# Altium project Senior Design Project.PrjPcb
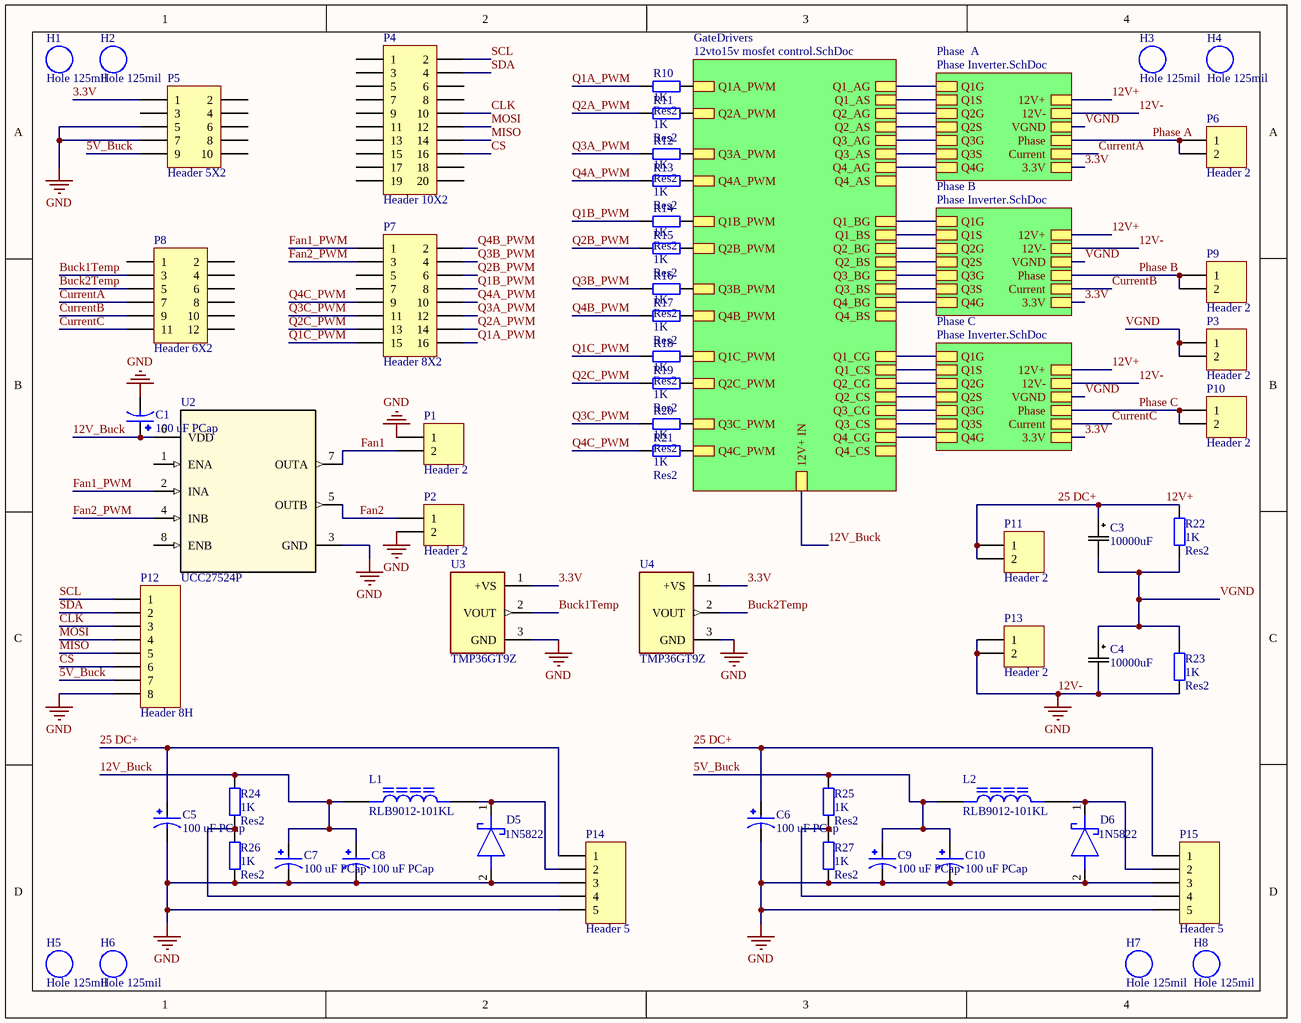
[diagram p0: DCtoAC Schematic.SchDoc]
4 sheets, 186 parts. Net scope: hierarchical (ports join the sheet entries above them; power ports are global).
Board file: Inverter PCB.PcbDoc
Sheets:
  DCtoAC Schematic.SchDoc
    GateDrivers = 12vto15v mosfet control.SchDoc
      Power = Power Supply.SchDoc
    Phase  A = Phase Inverter.SchDoc
    Phase B = Phase Inverter.SchDoc
    Phase C = Phase Inverter.SchDoc

## Sheet DCtoAC Schematic.SchDoc
size A; SheetNumber: 1; SheetTotal: 4; SPICEModelCacheUNANASZX: <root> / <DocumentId>UNANASZX</DocumentId> / </root>

### Parts
C1  100 uF PCap  [100uF PCap]
C3  10000uF  [CAP_UBY_18X35P5_NCH]
C4  10000uF  [CAP_UBY_18X35P5_NCH]
C5  100 uF PCap  [100uF PCap]
C6  100 uF PCap  [100uF PCap]
C7  100 uF PCap  [100uF PCap]
C8  100 uF PCap  [100uF PCap]
C9  100 uF PCap  [100uF PCap]
C10  100 uF PCap  [100uF PCap]
D5  1N5822  [DIOAD3070W130L950D530]
D6  1N5822  [DIOAD3070W130L950D530]
H1  Hole 125mil  [Hole 125mil]
H2  Hole 125mil  [Hole 125mil]
H3  Hole 125mil  [Hole 125mil]
H4  Hole 125mil  [Hole 125mil]
H5  Hole 125mil  [Hole 125mil]
H6  Hole 125mil  [Hole 125mil]
H7  Hole 125mil  [Hole 125mil]
H8  Hole 125mil  [Hole 125mil]
L1  RLB9012-101KL  [IND_RLB9012-101KL]
L2  RLB9012-101KL  [IND_RLB9012-101KL]
P1  Header 2  [HDR1X2]
P2  Header 2  [HDR1X2]
P3  Header 2  [HDR1X2]
P4  Header 10X2  [HDR2X10]
P5  Header 5X2  [HDR2X5]
P6  Header 2  [HDR1X2]
P7  Header 8X2  [HDR2X8]
P8  Header 6X2  [HDR2X6]
P9  Header 2  [HDR1X2]
P10  Header 2  [HDR1X2]
P11  Header 2  [HDR1X2]
P12  Header 8H  [HDR1X8H]
P13  Header 2  [HDR1X2]
P14  Header 5  [HDR1X5]
P15  Header 5  [HDR1X5]
R10  Res2  value 1K  [AXIAL-0.4]
R11  Res2  value 1K  [AXIAL-0.4]
R12  Res2  value 1K  [AXIAL-0.4]
R13  Res2  value 1K  [AXIAL-0.4]
R14  Res2  value 1K  [AXIAL-0.4]
R15  Res2  value 1K  [AXIAL-0.4]
R16  Res2  value 1K  [AXIAL-0.4]
R17  Res2  value 1K  [AXIAL-0.4]
R18  Res2  value 1K  [AXIAL-0.4]
R19  Res2  value 1K  [AXIAL-0.4]
R20  Res2  value 1K  [AXIAL-0.4]
R21  Res2  value 1K  [AXIAL-0.4]
R22  Res2  value 1K  [AXIAL-0.4]
R23  Res2  value 1K  [AXIAL-0.4]
R24  Res2  value 1K  [AXIAL-0.4]
R25  Res2  value 1K  [AXIAL-0.4]
R26  Res2  value 1K  [AXIAL-0.4]
R27  Res2  value 1K  [AXIAL-0.4]
U2  UCC27524P  [P0008A]
U3  TMP36GT9Z  [TO92127P521H733-3]
U4  TMP36GT9Z  [TO92127P521H733-3]

### Sub-sheets
GateDrivers = 12vto15v mosfet control.SchDoc: Q1A_PWM, Q1_AG, Q1_AS, Q2A_PWM, Q2_AG, Q2_AS, Q3A_PWM, Q3_AG, Q3_AS, Q4A_PWM, Q4_AG, Q4_AS, Q1B_PWM, Q1_BG, Q1_BS, Q2B_PWM, Q2_BG, Q2_BS, Q3B_PWM, Q3_BG, Q3_BS, Q4B_PWM, Q4_BG, Q4_BS, Q1C_PWM, Q1_CG, Q1_CS, Q2C_PWM, Q2_CG, Q2_CS, Q3C_PWM, Q3_CG, Q3_CS, Q4C_PWM, Q4_CG, Q4_CS, 12V+ IN
Phase  A = Phase Inverter.SchDoc: Q1G, Q2G, Q3G, 12V+, Q1S, Q3S, 12V-, Q4G, Q2S, Phase, VGND, 3.3V, Current
Phase B = Phase Inverter.SchDoc: Q1G, Q2G, Q3G, 12V+, Q1S, Q3S, 12V-, Q4G, Q2S, Phase, VGND, Current, 3.3V
Phase C = Phase Inverter.SchDoc: Q1G, Q2G, Q3G, 12V+, Q1S, Q3S, 12V-, Q4G, Q2S, Phase, VGND, Current, 3.3V

### Nets
12V-: C1.N C4.2 C5.N C6.N C7.N C8.N C9.N C10.N D5.2(A) D6.2(A) P1.1 P2.2 P5.5 P5.7 P12.8 P13.1 P13.2 P14.3 P14.5 P15.3 P15.5 R23.1 R26.2 R27.2 U2.3(GND) U3.3(GND) U4.3(GND) ; sheet Phase  A/12V-, sheet Phase B/12V-, sheet Phase C/12V-  [also labelled GND]
3.3V: P5.1 U3.1(+VS) U4.1(+VS) ; sheet Phase  A/3.3V, sheet Phase B/3.3V, sheet Phase C/3.3V
5V_Buck: C9.P C10.P L2.1 P5.9 P12.7 R25.1
12V+: C3.1 C5.P C6.P P11.1 P11.2 P14.1 P15.1 R22.2 ; sheet Phase  A/12V+, sheet Phase B/12V+, sheet Phase C/12V+  [also labelled 25 DC+]
12V_Buck: C1.P C7.P C8.P L1.1 R24.1 U2.6(VDD) ; sheet GateDrivers/12V+ IN
Buck1Temp: P8.3 U3.2(VOUT)
Buck2Temp: P8.5 U4.2(VOUT)
CLK: P4.10 P12.3
CS: P4.16 P12.6
CurrentA: P8.7 ; sheet Phase  A/Current
CurrentB: P8.9 ; sheet Phase B/Current
CurrentC: P8.11 ; sheet Phase C/Current
Fan1: P1.2 U2.7(OUTA)
Fan1_PWM: P7.1 U2.2(INA)
Fan2: P2.1 U2.5(OUTB)
Fan2_PWM: P7.3 U2.4(INB)
MISO: P4.14 P12.5
MOSI: P4.12 P12.4
Phase A: P6.1 P6.2 ; sheet Phase  A/Phase
Phase B: P9.1 P9.2 ; sheet Phase B/Phase
Phase C: P10.1 P10.2 ; sheet Phase C/Phase
Q1A-: sheet GateDrivers/Q1_AS, sheet Phase  A/Q1S
Q1A_PWM: P7.16 R10.1
Q1B-: sheet GateDrivers/Q1_BS, sheet Phase B/Q1S
Q1B_PWM: P7.8 R14.1
Q1C-: sheet GateDrivers/Q1_CS, sheet Phase C/Q1S
Q1C_PWM: P7.15 R18.1
Q2A-: sheet GateDrivers/Q2_AS, sheet Phase  A/Q2S
Q2A_PWM: P7.14 R11.1
Q2B-: sheet GateDrivers/Q2_BS, sheet Phase B/Q2S
Q2B_PWM: P7.6 R15.1
Q2C-: sheet GateDrivers/Q2_CS, sheet Phase C/Q2S
Q2C_PWM: P7.13 R19.1
Q3A-: sheet GateDrivers/Q3_AS, sheet Phase  A/Q3S
Q3A_PWM: P7.12 R12.1
Q3B-: sheet GateDrivers/Q3_BS, sheet Phase B/Q3S
Q3B_PWM: P7.4 R16.1
Q3C-: sheet GateDrivers/Q3_CS, sheet Phase C/Q3S
Q3C_PWM: P7.11 R20.1
Q4A_PWM: P7.10 R13.1
Q4B_PWM: P7.2 R17.1
Q4C_PWM: P7.9 R21.1
SCL: P4.2 P12.1
SDA: P4.4 P12.2
VGND: C3.2 C4.1 P3.1 P3.2 R22.1 R23.2 ; sheet Phase  A/VGND, sheet Phase B/VGND, sheet Phase C/VGND
NetC11_2: R10.2 ; sheet GateDrivers/Q1A_PWM
NetC12_2: R18.2 ; sheet GateDrivers/Q1C_PWM
NetC13_2: R11.2 ; sheet GateDrivers/Q2A_PWM
NetC14_2: R19.2 ; sheet GateDrivers/Q2C_PWM
NetC15_2: R12.2 ; sheet GateDrivers/Q3A_PWM
NetC16_2: R20.2 ; sheet GateDrivers/Q3C_PWM
NetC17_2: R13.2 ; sheet GateDrivers/Q4A_PWM
NetC18_2: R21.2 ; sheet GateDrivers/Q4C_PWM
NetC19_2: R14.2 ; sheet GateDrivers/Q1B_PWM
NetC20_2: R16.2 ; sheet GateDrivers/Q3B_PWM
NetC21_2: R15.2 ; sheet GateDrivers/Q2B_PWM
NetC22_2: R17.2 ; sheet GateDrivers/Q4B_PWM
NetD5_1: D5.1(K) L1.2 P14.2
NetD6_1: D6.1(K) L2.2 P15.2
NetP14_4: P14.4 R24.2 R26.1
NetP15_4: P15.4 R25.2 R27.1
NetR28_Phase_A_1: sheet GateDrivers/Q1_AG, sheet Phase  A/Q1G
NetR28_Phase_B_1: sheet GateDrivers/Q1_BG, sheet Phase B/Q1G
NetR28_Phase_C_1: sheet GateDrivers/Q1_CG, sheet Phase C/Q1G
NetR29_Phase_A_1: sheet GateDrivers/Q2_AG, sheet Phase  A/Q2G
NetR29_Phase_B_1: sheet GateDrivers/Q2_BG, sheet Phase B/Q2G
NetR29_Phase_C_1: sheet GateDrivers/Q2_CG, sheet Phase C/Q2G
NetR31_Phase_A_1: sheet GateDrivers/Q3_AG, sheet Phase  A/Q3G
NetR31_Phase_B_1: sheet GateDrivers/Q3_BG, sheet Phase B/Q3G
NetR31_Phase_C_1: sheet GateDrivers/Q3_CG, sheet Phase C/Q3G
NetR35_Phase_A_1: sheet GateDrivers/Q4_AG, sheet Phase  A/Q4G
NetR35_Phase_B_1: sheet GateDrivers/Q4_BG, sheet Phase B/Q4G
NetR35_Phase_C_1: sheet GateDrivers/Q4_CG, sheet Phase C/Q4G

Not connected (* = marked no-connect by the designer): P4 1 3 5 6 7 8 9 11 13 15 17 18 19 20; P5 2 3 4 6 8 10; P7 5 7; P8 1 2 4 6 8 10 12; U2 1(ENA) 8(ENB)

### Library data of the parts
C1 C5-C10 = 100 uF PCap: Capacitor; Aluminum Electrolytic; Radial Al Electrolytic Cap; 100uF 63V; MF: Panasonic Electronic; MP: EEU-FC1J101; Package: RADIAL-2 Panasonic; Price: None; Check_prices: https://www.snapeda.com/parts/EEU-FC1J101/Panasonic%20Electronic%20Components/view-part/494707/?ref=eda; Value: *; SnapEDA_Link: https://www.snapeda.com/parts/EEU-FC1J101/Panasonic%20Electronic%20Components/view-part/494707/?ref=snap; Availability: In Stock
C3 C4 = 10000uF: No Description Available; Mfr_Name: Nichicon
D5 D6 = 1N5822: Schottky Diode; Manufacturer_Name: STMicroelectronics; Datasheet Link: http://www.st.com/web/en/resource/technical/document/datasheet/CD00001626.pdf; Manufacturer_Part_Number: 1N5822; Mouser Part Number: 511-1N5822; Mouser Price/Stock: https://www.mouser.co.uk/ProductDetail/STMicroelectronics/1N5822?qs=JV7lzlMm3yJ50hlrGV6%252BnQ%3D%3D; Arrow Part Number: 1N5822; Arrow Price/Stock: https://www.arrow.com/en/products/1n5822/stmicroelectronics?utm_currency=USD&region=nac
P1-P3 P6 P9-P11 P13 = Header 2: Header, 2-Pin; LatestRevisionDate: 17-Jul-2002; LatestRevisionNote: Re-released for DXP Platform.; Publisher: Altium Limited
P4 = Header 10X2: Header, 10-Pin, Dual row; LatestRevisionDate: 17-Jul-2002; LatestRevisionNote: Re-released for DXP Platform.; Publisher: Altium Limited
P5 = Header 5X2: Header, 5-Pin, Dual row; LatestRevisionDate: 17-Jul-2002; LatestRevisionNote: Re-released for DXP Platform.; Publisher: Altium Limited
P7 = Header 8X2: Header, 8-Pin, Dual row; LatestRevisionDate: 17-Jul-2002; LatestRevisionNote: Re-released for DXP Platform.; Publisher: Altium Limited
P8 = Header 6X2: Header, 6-Pin, Dual row; LatestRevisionDate: 17-Jul-2002; LatestRevisionNote: Re-released for DXP Platform.; Publisher: Altium Limited
P12 = Header 8H: Header, 8-Pin, Right Angle; LatestRevisionDate: 17-Jul-2002; LatestRevisionNote: Re-released for DXP Platform.; Publisher: Altium Limited
P14 P15 = Header 5: Header, 5-Pin; LatestRevisionDate: 17-Jul-2002; LatestRevisionNote: Re-released for DXP Platform.; Publisher: Altium Limited
R10-R27 = Res2: Resistor; Published: 8-Jun-2000; LatestRevisionDate: 17-Jul-2002; LatestRevisionNote: Re-released for DXP Platform.; PackageReference: AXIAL-0.4; Publisher: Altium Limited; PackageDescription: Axial Device, Thru-Hole; 2 Leads; 0.4 in Pin Spacing
U2 = UCC27524P: IC Gate; Mfr_Name: Texas Instruments; TYPE: TYPE; RefDes: RefDes
U3 U4 = TMP36GT9Z: Voltage Output Temperature Sensors; MF: Analog Devices; Check_prices: https://www.snapeda.com/parts/TMP36GT9Z/Analog+Devices/view-part/?ref=eda; Price: None; MP: TMP36GT9Z; SnapEDA_Link: https://www.snapeda.com/parts/TMP36GT9Z/Analog+Devices/view-part/?ref=snap; Availability: In Stock; Value: *; Purchase-URL: https://pricing.snapeda.com/search/part/TMP36GT9Z/?ref=eda; Package: TO-3 Analog Devices
L1 L2 = RLB9012-101KL: Value: *; Package: None; Price: None; Availability: Unavailable; MP: RLB9012-101KL

## Sheet 12vto15v mosfet control.SchDoc
size A; SheetNumber: 2; SheetTotal: 4
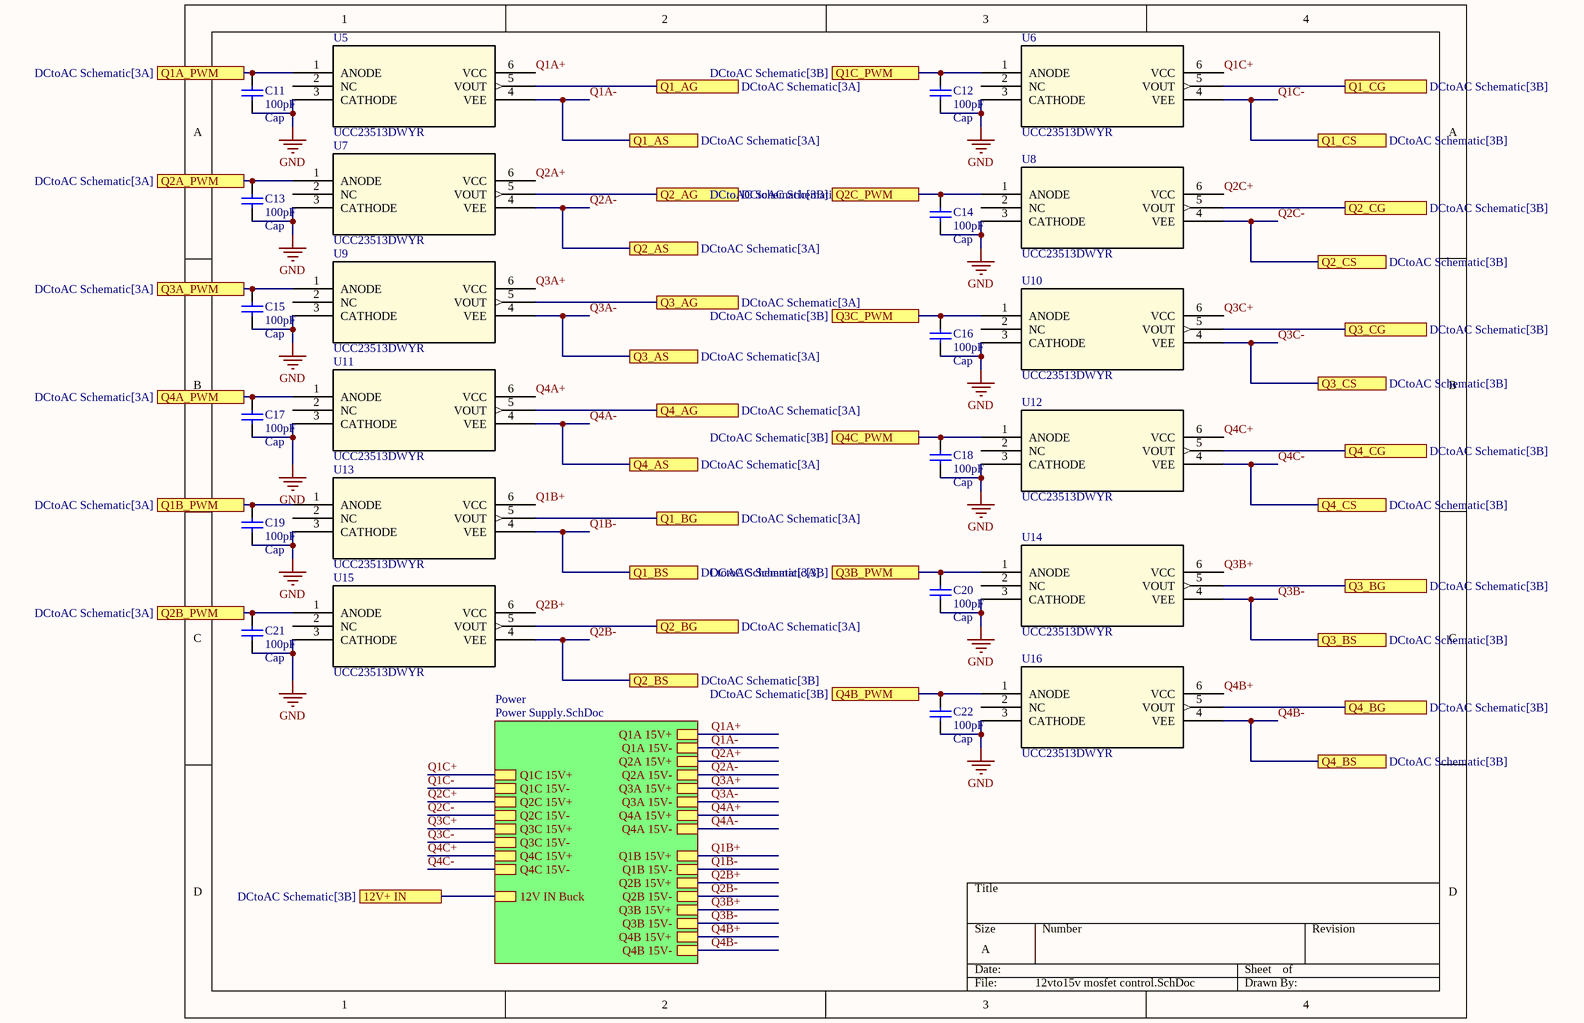
[diagram p1: 12vto15v mosfet control.SchDoc]

### Parts
C11  Cap  value 100pF  [RAD-0.3]
C12  Cap  value 100pF  [RAD-0.3]
C13  Cap  value 100pF  [RAD-0.3]
C14  Cap  value 100pF  [RAD-0.3]
C15  Cap  value 100pF  [RAD-0.3]
C16  Cap  value 100pF  [RAD-0.3]
C17  Cap  value 100pF  [RAD-0.3]
C18  Cap  value 100pF  [RAD-0.3]
C19  Cap  value 100pF  [RAD-0.3]
C20  Cap  value 100pF  [RAD-0.3]
C21  Cap  value 100pF  [RAD-0.3]
C22  Cap  value 100pF  [RAD-0.3]
U5  UCC23513DWYR  [DWY6_TEX]
U6  UCC23513DWYR  [DWY6_TEX]
U7  UCC23513DWYR  [DWY6_TEX]
U8  UCC23513DWYR  [DWY6_TEX]
U9  UCC23513DWYR  [DWY6_TEX]
U10  UCC23513DWYR  [DWY6_TEX]
U11  UCC23513DWYR  [DWY6_TEX]
U12  UCC23513DWYR  [DWY6_TEX]
U13  UCC23513DWYR  [DWY6_TEX]
U14  UCC23513DWYR  [DWY6_TEX]
U15  UCC23513DWYR  [DWY6_TEX]
U16  UCC23513DWYR  [DWY6_TEX]

### Sub-sheets
Power = Power Supply.SchDoc: Q1A 15V+, Q1A 15V-, Q2A 15V+, Q2A 15V-, Q3A 15V+, Q3A 15V-, Q4A 15V+, Q4A 15V-, Q1B 15V+, Q1B 15V-, Q2B 15V+, Q2B 15V-, Q3B 15V+, Q3B 15V-, Q4B 15V+, Q4B 15V-, Q1C 15V+, Q1C 15V-, Q2C 15V+, Q2C 15V-, Q3C 15V+, Q3C 15V-, Q4C 15V+, Q4C 15V-, 12V IN Buck

### Ports
12V+ IN (see DCtoAC Schematic[3B]), Q1_AG (see DCtoAC Schematic[3A]), Q1_AS (see DCtoAC Schematic[3A]), Q1_BG (see DCtoAC Schematic[3A]), Q1_BS (see DCtoAC Schematic[3A]), Q1_CG (see DCtoAC Schematic[3B]), Q1_CS (see DCtoAC Schematic[3B]), Q1A_PWM (see DCtoAC Schematic[3A]), Q1B_PWM (see DCtoAC Schematic[3A]), Q1C_PWM (see DCtoAC Schematic[3B]), Q2_AG (see DCtoAC Schematic[3A]), Q2_AS (see DCtoAC Schematic[3A]), Q2_BG (see DCtoAC Schematic[3A]), Q2_BS (see DCtoAC Schematic[3B]), Q2_CG (see DCtoAC Schematic[3B]), Q2_CS (see DCtoAC Schematic[3B]), Q2A_PWM (see DCtoAC Schematic[3A]), Q2B_PWM (see DCtoAC Schematic[3A]), Q2C_PWM (see DCtoAC Schematic[3B]), Q3_AG (see DCtoAC Schematic[3A]), Q3_AS (see DCtoAC Schematic[3A]), Q3_BG (see DCtoAC Schematic[3B]), Q3_BS (see DCtoAC Schematic[3B]), Q3_CG (see DCtoAC Schematic[3B]), Q3_CS (see DCtoAC Schematic[3B]), Q3A_PWM (see DCtoAC Schematic[3A]), Q3B_PWM (see DCtoAC Schematic[3B]), Q3C_PWM (see DCtoAC Schematic[3B]), Q4_AG (see DCtoAC Schematic[3A]), Q4_AS (see DCtoAC Schematic[3A]), Q4_BG (see DCtoAC Schematic[3B]), Q4_BS (see DCtoAC Schematic[3B]), Q4_CG (see DCtoAC Schematic[3B]), Q4_CS (see DCtoAC Schematic[3B]), Q4A_PWM (see DCtoAC Schematic[3A]), Q4B_PWM (see DCtoAC Schematic[3B]), Q4C_PWM (see DCtoAC Schematic[3B])

### Nets
GND: C11.1 C12.1 C13.1 C14.1 C15.1 C16.1 C17.1 C18.1 C19.1 C20.1 C21.1 C22.1 U5.3(CATHODE) U6.3(CATHODE) U7.3(CATHODE) U8.3(CATHODE) U9.3(CATHODE) U10.3(CATHODE) U11.3(CATHODE) U12.3(CATHODE) U13.3(CATHODE) U14.3(CATHODE) U15.3(CATHODE) U16.3(CATHODE)  [project net 12V-]
12V_Buck: port 12V+ IN, sheet Power/12V IN Buck
Q1A+: U5.6(VCC) ; sheet Power/Q1A 15V+
Q1A-: U5.4(VEE) ; port Q1_AS, sheet Power/Q1A 15V-
Q1B+: U13.6(VCC) ; sheet Power/Q1B 15V+
Q1B-: U13.4(VEE) ; port Q1_BS, sheet Power/Q1B 15V-
Q1C+: U6.6(VCC) ; sheet Power/Q1C 15V+
Q1C-: U6.4(VEE) ; port Q1_CS, sheet Power/Q1C 15V-
Q2A+: U7.6(VCC) ; sheet Power/Q2A 15V+
Q2A-: U7.4(VEE) ; port Q2_AS, sheet Power/Q2A 15V-
Q2B+: U15.6(VCC) ; sheet Power/Q2B 15V+
Q2B-: U15.4(VEE) ; port Q2_BS, sheet Power/Q2B 15V-
Q2C+: U8.6(VCC) ; sheet Power/Q2C 15V+
Q2C-: U8.4(VEE) ; port Q2_CS, sheet Power/Q2C 15V-
Q3A+: U9.6(VCC) ; sheet Power/Q3A 15V+
Q3A-: U9.4(VEE) ; port Q3_AS, sheet Power/Q3A 15V-
Q3B+: U14.6(VCC) ; sheet Power/Q3B 15V+
Q3B-: U14.4(VEE) ; port Q3_BS, sheet Power/Q3B 15V-
Q3C+: U10.6(VCC) ; sheet Power/Q3C 15V+
Q3C-: U10.4(VEE) ; port Q3_CS, sheet Power/Q3C 15V-
Q4A+: U11.6(VCC) ; sheet Power/Q4A 15V+
Q4A-: U11.4(VEE) ; port Q4_AS, sheet Power/Q4A 15V-
Q4B+: U16.6(VCC) ; sheet Power/Q4B 15V+
Q4B-: U16.4(VEE) ; port Q4_BS, sheet Power/Q4B 15V-
Q4C+: U12.6(VCC) ; sheet Power/Q4C 15V+
Q4C-: U12.4(VEE) ; port Q4_CS, sheet Power/Q4C 15V-
NetC11_2: C11.2 U5.1(ANODE) ; port Q1A_PWM
NetC12_2: C12.2 U6.1(ANODE) ; port Q1C_PWM
NetC13_2: C13.2 U7.1(ANODE) ; port Q2A_PWM
NetC14_2: C14.2 U8.1(ANODE) ; port Q2C_PWM
NetC15_2: C15.2 U9.1(ANODE) ; port Q3A_PWM
NetC16_2: C16.2 U10.1(ANODE) ; port Q3C_PWM
NetC17_2: C17.2 U11.1(ANODE) ; port Q4A_PWM
NetC18_2: C18.2 U12.1(ANODE) ; port Q4C_PWM
NetC19_2: C19.2 U13.1(ANODE) ; port Q1B_PWM
NetC20_2: C20.2 U14.1(ANODE) ; port Q3B_PWM
NetC21_2: C21.2 U15.1(ANODE) ; port Q2B_PWM
NetC22_2: C22.2 U16.1(ANODE) ; port Q4B_PWM
NetR28_Phase_A_1: U5.5(VOUT) ; port Q1_AG
NetR28_Phase_B_1: U13.5(VOUT) ; port Q1_BG
NetR28_Phase_C_1: U6.5(VOUT) ; port Q1_CG
NetR29_Phase_A_1: U7.5(VOUT) ; port Q2_AG
NetR29_Phase_B_1: U15.5(VOUT) ; port Q2_BG
NetR29_Phase_C_1: U8.5(VOUT) ; port Q2_CG
NetR31_Phase_A_1: U9.5(VOUT) ; port Q3_AG
NetR31_Phase_B_1: U14.5(VOUT) ; port Q3_BG
NetR31_Phase_C_1: U10.5(VOUT) ; port Q3_CG
NetR35_Phase_A_1: U11.5(VOUT) ; port Q4_AG
NetR35_Phase_B_1: U16.5(VOUT) ; port Q4_BG
NetR35_Phase_C_1: U12.5(VOUT) ; port Q4_CG

Not connected (* = marked no-connect by the designer): U5 2(NC); U6 2(NC); U7 2(NC); U8 2(NC); U9 2(NC); U10 2(NC); U11 2(NC); U12 2(NC); U13 2(NC); U14 2(NC); U15 2(NC); U16 2(NC)

### Library data of the parts
C11-C22 = Cap: Capacitor; Published: 8-Jun-2000; LatestRevisionDate: 17-Jul-2002; LatestRevisionNote: Re-released for DXP Platform.; PackageReference: RAD-0.3; Publisher: Altium Limited; PackageDescription: Radial Cap, Thru-Hole; 2 Leads; 0.3 in Pin Spacing
U5-U16 = UCC23513DWYR: No Description Available; Mfr_Name: Texas Instruments; RefDes: RefDes; Type: Type

## Sheet Power Supply.SchDoc
size A; SheetNumber: 3; SheetTotal: 4
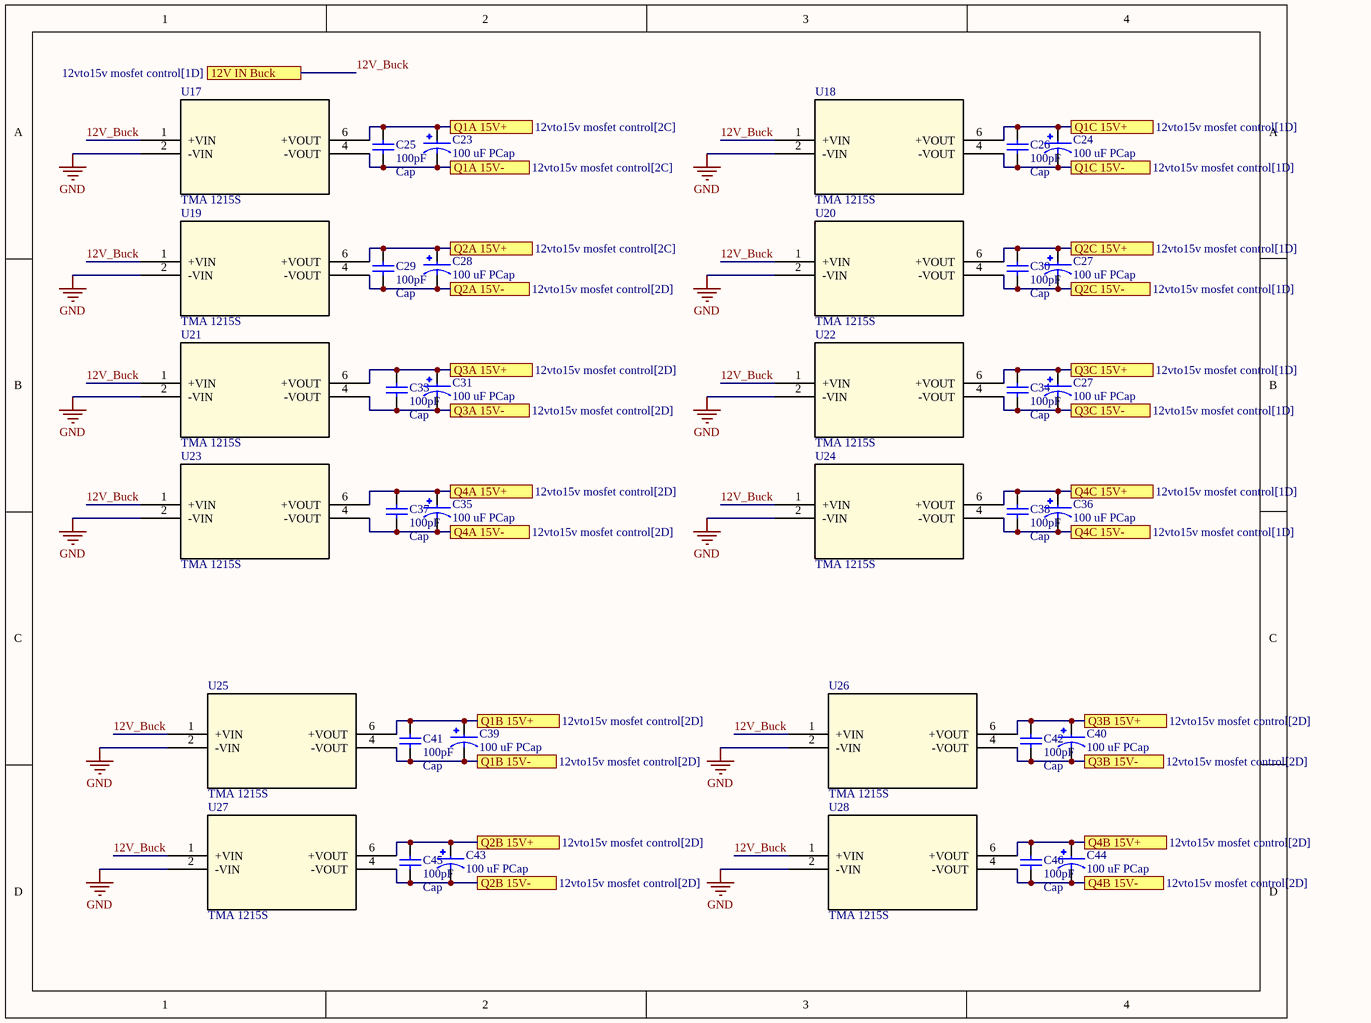
[diagram p2: Power Supply.SchDoc]

### Parts
(Parts that share a designator on the sheet are numbered #1, #2 ... from top to bottom, then left to right.)
C23  100 uF PCap  [100uF PCap]
C24  100 uF PCap  [100uF PCap]
C25  Cap  value 100pF  [RAD-0.3]
C26  Cap  value 100pF  [RAD-0.3]
C27#1  100 uF PCap  [100uF PCap]
C27#2  100 uF PCap  [100uF PCap]
C28  100 uF PCap  [100uF PCap]
C29  Cap  value 100pF  [RAD-0.3]
C30  Cap  value 100pF  [RAD-0.3]
C31  100 uF PCap  [100uF PCap]
C33  Cap  value 100pF  [RAD-0.3]
C34  Cap  value 100pF  [RAD-0.3]
C35  100 uF PCap  [100uF PCap]
C36  100 uF PCap  [100uF PCap]
C37  Cap  value 100pF  [RAD-0.3]
C38  Cap  value 100pF  [RAD-0.3]
C39  100 uF PCap  [100uF PCap]
C40  100 uF PCap  [100uF PCap]
C41  Cap  value 100pF  [RAD-0.3]
C42  Cap  value 100pF  [RAD-0.3]
C43  100 uF PCap  [100uF PCap]
C44  100 uF PCap  [100uF PCap]
C45  Cap  value 100pF  [RAD-0.3]
C46  Cap  value 100pF  [RAD-0.3]
U17  TMA 1215S  [TMA SINGLE_TRP]
U18  TMA 1215S  [TMA SINGLE_TRP]
U19  TMA 1215S  [TMA SINGLE_TRP]
U20  TMA 1215S  [TMA SINGLE_TRP]
U21  TMA 1215S  [TMA SINGLE_TRP]
U22  TMA 1215S  [TMA SINGLE_TRP]
U23  TMA 1215S  [TMA SINGLE_TRP]
U24  TMA 1215S  [TMA SINGLE_TRP]
U25  TMA 1215S  [TMA SINGLE_TRP]
U26  TMA 1215S  [TMA SINGLE_TRP]
U27  TMA 1215S  [TMA SINGLE_TRP]
U28  TMA 1215S  [TMA SINGLE_TRP]

### Ports
12V IN Buck (see 12vto15v mosfet control[1D]), Q1A 15V+ (see 12vto15v mosfet control[2C]), Q1A 15V- (see 12vto15v mosfet control[2C]), Q1B 15V+ (see 12vto15v mosfet control[2D]), Q1B 15V- (see 12vto15v mosfet control[2D]), Q1C 15V+ (see 12vto15v mosfet control[1D]), Q1C 15V- (see 12vto15v mosfet control[1D]), Q2A 15V+ (see 12vto15v mosfet control[2C]), Q2A 15V- (see 12vto15v mosfet control[2D]), Q2B 15V+ (see 12vto15v mosfet control[2D]), Q2B 15V- (see 12vto15v mosfet control[2D]), Q2C 15V+ (see 12vto15v mosfet control[1D]), Q2C 15V- (see 12vto15v mosfet control[1D]), Q3A 15V+ (see 12vto15v mosfet control[2D]), Q3A 15V- (see 12vto15v mosfet control[2D]), Q3B 15V+ (see 12vto15v mosfet control[2D]), Q3B 15V- (see 12vto15v mosfet control[2D]), Q3C 15V+ (see 12vto15v mosfet control[1D]), Q3C 15V- (see 12vto15v mosfet control[1D]), Q4A 15V+ (see 12vto15v mosfet control[2D]), Q4A 15V- (see 12vto15v mosfet control[2D]), Q4B 15V+ (see 12vto15v mosfet control[2D]), Q4B 15V- (see 12vto15v mosfet control[2D]), Q4C 15V+ (see 12vto15v mosfet control[1D]), Q4C 15V- (see 12vto15v mosfet control[1D])

### Nets
GND: U17.2(-VIN) U18.2(-VIN) U19.2(-VIN) U20.2(-VIN) U21.2(-VIN) U22.2(-VIN) U23.2(-VIN) U24.2(-VIN) U25.2(-VIN) U26.2(-VIN) U27.2(-VIN) U28.2(-VIN)  [project net 12V-]
12V_Buck: U17.1(+VIN) U18.1(+VIN) U19.1(+VIN) U20.1(+VIN) U21.1(+VIN) U22.1(+VIN) U23.1(+VIN) U24.1(+VIN) U25.1(+VIN) U26.1(+VIN) U27.1(+VIN) U28.1(+VIN) ; port 12V IN Buck
Q1A+: C23.P C25.1 U17.6(+VOUT) ; port Q1A 15V+
Q1A-: C23.N C25.2 U17.4(-VOUT) ; port Q1A 15V-
Q1B+: C39.P C41.2 U25.6(+VOUT) ; port Q1B 15V+
Q1B-: C39.N C41.1 U25.4(-VOUT) ; port Q1B 15V-
Q1C+: C24.P C26.2 U18.6(+VOUT) ; port Q1C 15V+
Q1C-: C24.N C26.1 U18.4(-VOUT) ; port Q1C 15V-
Q2A+: C28.P C29.2 U19.6(+VOUT) ; port Q2A 15V+
Q2A-: C28.N C29.1 U19.4(-VOUT) ; port Q2A 15V-
Q2B+: C43.P C45.2 U27.6(+VOUT) ; port Q2B 15V+
Q2B-: C43.N C45.1 U27.4(-VOUT) ; port Q2B 15V-
Q2C+: C27#1.P C30.2 U20.6(+VOUT) ; port Q2C 15V+
Q2C-: C27#1.N C30.1 U20.4(-VOUT) ; port Q2C 15V-
Q3A+: C31.P C33.2 U21.6(+VOUT) ; port Q3A 15V+
Q3A-: C31.N C33.1 U21.4(-VOUT) ; port Q3A 15V-
Q3B+: C40.P C42.2 U26.6(+VOUT) ; port Q3B 15V+
Q3B-: C40.N C42.1 U26.4(-VOUT) ; port Q3B 15V-
Q3C+: C27#2.P C34.2 U22.6(+VOUT) ; port Q3C 15V+
Q3C-: C27#2.N C34.1 U22.4(-VOUT) ; port Q3C 15V-
Q4A+: C35.P C37.2 U23.6(+VOUT) ; port Q4A 15V+
Q4A-: C35.N C37.1 U23.4(-VOUT) ; port Q4A 15V-
Q4B+: C44.P C46.2 U28.6(+VOUT) ; port Q4B 15V+
Q4B-: C44.N C46.1 U28.4(-VOUT) ; port Q4B 15V-
Q4C+: C36.P C38.2 U24.6(+VOUT) ; port Q4C 15V+
Q4C-: C36.N C38.1 U24.4(-VOUT) ; port Q4C 15V-

### Library data of the parts
C23 C24 C27#1 C27#2 C28 C31 C35 C36 C39 C40 C43 C44 = 100 uF PCap: as C1 on sheet DCtoAC Schematic; Package: RADIAL-2 Panasonic; Price: None; Check_prices: https://www.snapeda.com/parts/EEU-FC1J101/Panasonic%20Electronic%20Components/view-part/494707/?ref=eda; Value: *; SnapEDA_Link: https://www.snapeda.com/parts/EEU-FC1J101/Panasonic%20Electronic%20Components/view-part/494707/?ref=snap; Availability: In Stock
C25 C26 C29 C30 C33 C34 C37 C38 C41 C42 C45 C46 = Cap: Capacitor; Published: 8-Jun-2000; LatestRevisionDate: 17-Jul-2002; LatestRevisionNote: Re-released for DXP Platform.; PackageReference: RAD-0.3; Publisher: Altium Limited; PackageDescription: Radial Cap, Thru-Hole; 2 Leads; 0.3 in Pin Spacing
U17-U28 = TMA 1215S: No Description Available; Mfr_Name: Traco Power; RefDes: RefDes; Type: Type

## Sheet Phase Inverter.SchDoc
size A; SheetNumber: 4; SheetTotal: 4
Used 3 times, as channels Phase  A, Phase B, Phase C. Parts and nets are listed once, with the designators drawn on the sheet.
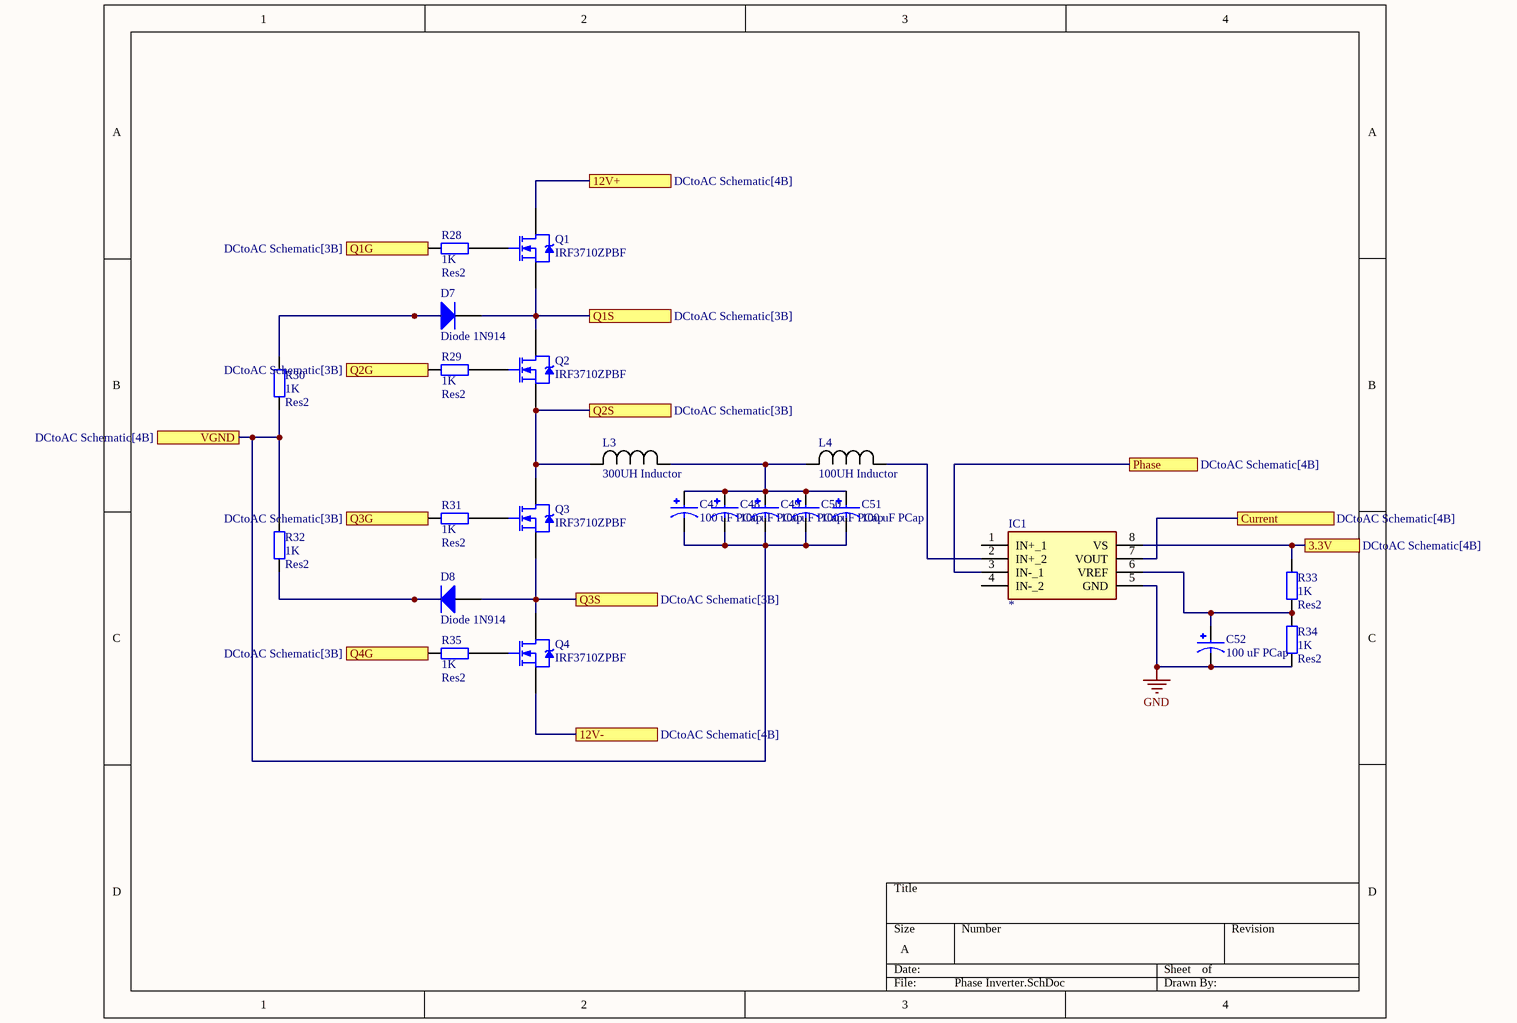
[diagram p3: Phase Inverter.SchDoc]

### Parts
C47  100 uF PCap  [100uF PCap]
C48  100 uF PCap  [100uF PCap]
C49  100 uF PCap  [100uF PCap]
C50  100 uF PCap  [100uF PCap]
C51  100 uF PCap  [100uF PCap]
C52  100 uF PCap  [100uF PCap]
D7  Diode 1N914  [DO-35]
D8  Diode 1N914  [DO-35]
IC1  *  [SOIC127P600X175-8N]
L3  300UH Inductor  [1430450C_MUR]
L4  100UH Inductor  [1410460C_MUR]
Q1  IRF3710ZPBF  [PG-TO220-3_INF]
Q2  IRF3710ZPBF  [PG-TO220-3_INF]
Q3  IRF3710ZPBF  [PG-TO220-3_INF]
Q4  IRF3710ZPBF  [PG-TO220-3_INF]
R28  Res2  value 1K  [AXIAL-0.4]
R29  Res2  value 1K  [AXIAL-0.4]
R30  Res2  value 1K  [AXIAL-0.4]
R31  Res2  value 1K  [AXIAL-0.4]
R32  Res2  value 1K  [AXIAL-0.4]
R33  Res2  value 1K  [AXIAL-0.4]
R34  Res2  value 1K  [AXIAL-0.4]
R35  Res2  value 1K  [AXIAL-0.4]

### Ports
3.3V (see DCtoAC Schematic[4B]), 12V+ (see DCtoAC Schematic[4B]), 12V- (see DCtoAC Schematic[4B]), Current (see DCtoAC Schematic[4B]), Phase (see DCtoAC Schematic[4B]), Q1G (see DCtoAC Schematic[3B]), Q1S (see DCtoAC Schematic[3B]), Q2G (see DCtoAC Schematic[3B]), Q2S (see DCtoAC Schematic[3B]), Q3G (see DCtoAC Schematic[3B]), Q3S (see DCtoAC Schematic[3B]), Q4G (see DCtoAC Schematic[3B]), VGND (see DCtoAC Schematic[4B])

### Nets
GND: C52.N IC1.5(GND) R34.2
3.3V: IC1.8(VS) R33.1 ; port 3.3V
12V+: Q1.2(D) ; port 12V+
12V-: Q4.3(S) ; port 12V-
Current: IC1.7(VOUT) ; port Current
Phase: IC1.3(IN-_1) ; port Phase
Q1G: R28.1 ; port Q1G
Q1S: D7.2(K) Q1.3(S) Q2.2(D) ; port Q1S
Q2G: R29.1 ; port Q2G
Q2S: L3.2 Q2.3(S) Q3.2(D) ; port Q2S
Q3G: R31.1 ; port Q3G
Q3S: D8.1(A) Q3.3(S) Q4.2(D) ; port Q3S
Q4G: R35.1 ; port Q4G
VGND: C47.N C48.N C49.N C50.N C51.N R30.1 R32.2 ; port VGND
NetC47_P: C47.P C48.P C49.P C50.P C51.P L3.1 L4.2
NetC52_P: C52.P IC1.6(VREF) R33.2 R34.1
NetD7_1: D7.1(A) R30.2
NetD8_2: D8.2(K) R32.1
NetIC1_2: IC1.2(IN+_2) L4.1
NetQ1_1: Q1.1(G) R28.2
NetQ2_1: Q2.1(G) R29.2
NetQ3_1: Q3.1(G) R31.2
NetQ4_1: Q4.1(G) R35.2

Not connected (* = marked no-connect by the designer): IC1 1(IN+_1) 4(IN-_2)

### Channels
Phase  A: designators end in _Phase_A; ports 3.3V=3.3V 12V+=12V+ 12V-=12V- Current=CurrentA Phase=Phase A Q1G=NetR28_Phase_A_1 Q1S=Q1A- Q2G=NetR29_Phase_A_1 Q2S=Q2A- Q3G=NetR31_Phase_A_1 Q3S=Q3A- Q4G=NetR35_Phase_A_1 VGND=VGND
Phase B: designators end in _Phase_B; ports 3.3V=3.3V 12V+=12V+ 12V-=12V- Current=CurrentB Phase=Phase B Q1G=NetR28_Phase_B_1 Q1S=Q1B- Q2G=NetR29_Phase_B_1 Q2S=Q2B- Q3G=NetR31_Phase_B_1 Q3S=Q3B- Q4G=NetR35_Phase_B_1 VGND=VGND
Phase C: designators end in _Phase_C; ports 3.3V=3.3V 12V+=12V+ 12V-=12V- Current=CurrentC Phase=Phase C Q1G=NetR28_Phase_C_1 Q1S=Q1C- Q2G=NetR29_Phase_C_1 Q2S=Q2C- Q3G=NetR31_Phase_C_1 Q3S=Q3C- Q4G=NetR35_Phase_C_1 VGND=VGND

### Library data of the parts
C47-C52 = 100 uF PCap: as C1 on sheet DCtoAC Schematic; Package: RADIAL-2 Panasonic; Price: None; Check_prices: https://www.snapeda.com/parts/EEU-FC1J101/Panasonic%20Electronic%20Components/view-part/494707/?ref=eda; Value: *; SnapEDA_Link: https://www.snapeda.com/parts/EEU-FC1J101/Panasonic%20Electronic%20Components/view-part/494707/?ref=snap; Availability: In Stock
D7 D8 = Diode 1N914: High Conductance Fast Diode; Published: 8-Jun-2000; LatestRevisionDate: 17-Jul-2002; LatestRevisionNote: Re-released for DXP Platform.; DatasheetVersion: 1997; PackageReference: DO-35; Publisher: Altium Limited; PackageDescription: Diode, Axial; Body 3.8 x 1.9 mm (LxDia. max), Lead Dia. 0.53 mm (max); Code_JEDEC: DO-204-AH; ComponentLink1Description: Manufacturer Link; ComponentLink1URL: http://www.fairchildsemi.com/; ComponentLink2Description: Datasheet; ComponentLink2URL: http://www.fairchildsemi.com/ds/1N%2F1N4448.pdf
IC1 = TMCS1100A2QDR: Integrated Circuit; Manufacturer_Name: Texas Instruments; Description: Board Mount Current Sensors Precision isolated current sensor with external reference; Datasheet Link: https://www.ti.com/lit/gpn/TMCS1100; Height: 1.75mm; Manufacturer_Part_Number: TMCS1100A2QDR; Mouser Part Number: 595-TMCS1100A2QDR; Mouser Price/Stock: https://www.mouser.co.uk/ProductDetail/Texas-Instruments/TMCS1100A2QDR?qs=sPbYRqrBIVnDChUnLpnImg%3D%3D; Arrow Part Number: TMCS1100A2QDR; Arrow Price/Stock: https://www.arrow.com/en/products/tmcs1100a2qdr/texas-instruments?utm_currency=USD&region=nac
L3 = 300UH Inductor: Mfr_Name: Murata
L4 = 100UH Inductor: Mfr_Name: Murata
Q1-Q4 = IRF3710ZPBF: N-Channel Power MOSFET; Note: Pin 2 is electrically connected to pin 4.; Published: 8-Jun-2000; LatestRevisionDate: 17-Jul-2002; LatestRevisionNote: Re-released for DXP Platform.; DatasheetVersion: PD-9.814; PackageVersion: Feb-1997; PackageReference: TO-220AB; Publisher: Altium Limited; PackageDescription: TO, Thru-Hole, Vertical, Heatsink Mounted; 3 In-Line Leads; Pitch 2.54 mm; ComponentLink1Description: Manufacturer Link; ComponentLink1URL: http://www.irf.com/
R28-R35 = Res2: Resistor; Published: 8-Jun-2000; LatestRevisionDate: 17-Jul-2002; LatestRevisionNote: Re-released for DXP Platform.; PackageReference: AXIAL-0.4; Publisher: Altium Limited; PackageDescription: Axial Device, Thru-Hole; 2 Leads; 0.4 in Pin Spacing

## Nets that join several sheets
12V-: DCtoAC Schematic (27 pins), 12vto15v mosfet control (24 pins), Power Supply (12 pins), Phase  A (C52_Phase_A.N IC1_Phase_A.5 Q4_Phase_A.3 R34_Phase_A.2), Phase B (C52_Phase_B.N IC1_Phase_B.5 Q4_Phase_B.3 R34_Phase_B.2), Phase C (C52_Phase_C.N IC1_Phase_C.5 Q4_Phase_C.3 R34_Phase_C.2)
3.3V: DCtoAC Schematic (P5.1 U3.1 U4.1), Phase  A (IC1_Phase_A.8 R33_Phase_A.1), Phase B (IC1_Phase_B.8 R33_Phase_B.1), Phase C (IC1_Phase_C.8 R33_Phase_C.1)
12V+: DCtoAC Schematic (8 pins), Phase  A (Q1_Phase_A.2), Phase B (Q1_Phase_B.2), Phase C (Q1_Phase_C.2)
12V_Buck: DCtoAC Schematic (6 pins), Power Supply (12 pins)
CurrentA: DCtoAC Schematic (P8.7), Phase  A (IC1_Phase_A.7)
CurrentB: DCtoAC Schematic (P8.9), Phase B (IC1_Phase_B.7)
CurrentC: DCtoAC Schematic (P8.11), Phase C (IC1_Phase_C.7)
NetC11_2: DCtoAC Schematic (R10.2), 12vto15v mosfet control (C11.2 U5.1)
NetC12_2: DCtoAC Schematic (R18.2), 12vto15v mosfet control (C12.2 U6.1)
NetC13_2: DCtoAC Schematic (R11.2), 12vto15v mosfet control (C13.2 U7.1)
NetC14_2: DCtoAC Schematic (R19.2), 12vto15v mosfet control (C14.2 U8.1)
NetC15_2: DCtoAC Schematic (R12.2), 12vto15v mosfet control (C15.2 U9.1)
NetC16_2: DCtoAC Schematic (R20.2), 12vto15v mosfet control (C16.2 U10.1)
NetC17_2: DCtoAC Schematic (R13.2), 12vto15v mosfet control (C17.2 U11.1)
NetC18_2: DCtoAC Schematic (R21.2), 12vto15v mosfet control (C18.2 U12.1)
NetC19_2: DCtoAC Schematic (R14.2), 12vto15v mosfet control (C19.2 U13.1)
NetC20_2: DCtoAC Schematic (R16.2), 12vto15v mosfet control (C20.2 U14.1)
NetC21_2: DCtoAC Schematic (R15.2), 12vto15v mosfet control (C21.2 U15.1)
NetC22_2: DCtoAC Schematic (R17.2), 12vto15v mosfet control (C22.2 U16.1)
NetR28_Phase_A_1: 12vto15v mosfet control (U5.5), Phase  A (R28_Phase_A.1)
NetR28_Phase_B_1: 12vto15v mosfet control (U13.5), Phase B (R28_Phase_B.1)
NetR28_Phase_C_1: 12vto15v mosfet control (U6.5), Phase C (R28_Phase_C.1)
NetR29_Phase_A_1: 12vto15v mosfet control (U7.5), Phase  A (R29_Phase_A.1)
NetR29_Phase_B_1: 12vto15v mosfet control (U15.5), Phase B (R29_Phase_B.1)
NetR29_Phase_C_1: 12vto15v mosfet control (U8.5), Phase C (R29_Phase_C.1)
NetR31_Phase_A_1: 12vto15v mosfet control (U9.5), Phase  A (R31_Phase_A.1)
NetR31_Phase_B_1: 12vto15v mosfet control (U14.5), Phase B (R31_Phase_B.1)
NetR31_Phase_C_1: 12vto15v mosfet control (U10.5), Phase C (R31_Phase_C.1)
NetR35_Phase_A_1: 12vto15v mosfet control (U11.5), Phase  A (R35_Phase_A.1)
NetR35_Phase_B_1: 12vto15v mosfet control (U16.5), Phase B (R35_Phase_B.1)
NetR35_Phase_C_1: 12vto15v mosfet control (U12.5), Phase C (R35_Phase_C.1)
Phase A: DCtoAC Schematic (P6.1 P6.2), Phase  A (IC1_Phase_A.3)
Phase B: DCtoAC Schematic (P9.1 P9.2), Phase B (IC1_Phase_B.3)
Phase C: DCtoAC Schematic (P10.1 P10.2), Phase C (IC1_Phase_C.3)
Q1A+: 12vto15v mosfet control (U5.6), Power Supply (C23.P C25.1 U17.6)
Q1A-: 12vto15v mosfet control (U5.4), Power Supply (C23.N C25.2 U17.4), Phase  A (D7_Phase_A.2 Q1_Phase_A.3 Q2_Phase_A.2)
Q1B+: 12vto15v mosfet control (U13.6), Power Supply (C39.P C41.2 U25.6)
Q1B-: 12vto15v mosfet control (U13.4), Power Supply (C39.N C41.1 U25.4), Phase B (D7_Phase_B.2 Q1_Phase_B.3 Q2_Phase_B.2)
Q1C+: 12vto15v mosfet control (U6.6), Power Supply (C24.P C26.2 U18.6)
Q1C-: 12vto15v mosfet control (U6.4), Power Supply (C24.N C26.1 U18.4), Phase C (D7_Phase_C.2 Q1_Phase_C.3 Q2_Phase_C.2)
Q2A+: 12vto15v mosfet control (U7.6), Power Supply (C28.P C29.2 U19.6)
Q2A-: 12vto15v mosfet control (U7.4), Power Supply (C28.N C29.1 U19.4), Phase  A (L3_Phase_A.2 Q2_Phase_A.3 Q3_Phase_A.2)
Q2B+: 12vto15v mosfet control (U15.6), Power Supply (C43.P C45.2 U27.6)
Q2B-: 12vto15v mosfet control (U15.4), Power Supply (C43.N C45.1 U27.4), Phase B (L3_Phase_B.2 Q2_Phase_B.3 Q3_Phase_B.2)
Q2C+: 12vto15v mosfet control (U8.6), Power Supply (C27#1.P C30.2 U20.6)
Q2C-: 12vto15v mosfet control (U8.4), Power Supply (C27#1.N C30.1 U20.4), Phase C (L3_Phase_C.2 Q2_Phase_C.3 Q3_Phase_C.2)
Q3A+: 12vto15v mosfet control (U9.6), Power Supply (C31.P C33.2 U21.6)
Q3A-: 12vto15v mosfet control (U9.4), Power Supply (C31.N C33.1 U21.4), Phase  A (D8_Phase_A.1 Q3_Phase_A.3 Q4_Phase_A.2)
Q3B+: 12vto15v mosfet control (U14.6), Power Supply (C40.P C42.2 U26.6)
Q3B-: 12vto15v mosfet control (U14.4), Power Supply (C40.N C42.1 U26.4), Phase B (D8_Phase_B.1 Q3_Phase_B.3 Q4_Phase_B.2)
Q3C+: 12vto15v mosfet control (U10.6), Power Supply (C27#2.P C34.2 U22.6)
Q3C-: 12vto15v mosfet control (U10.4), Power Supply (C27#2.N C34.1 U22.4), Phase C (D8_Phase_C.1 Q3_Phase_C.3 Q4_Phase_C.2)
Q4A+: 12vto15v mosfet control (U11.6), Power Supply (C35.P C37.2 U23.6)
Q4A-: 12vto15v mosfet control (U11.4), Power Supply (C35.N C37.1 U23.4)
Q4B+: 12vto15v mosfet control (U16.6), Power Supply (C44.P C46.2 U28.6)
Q4B-: 12vto15v mosfet control (U16.4), Power Supply (C44.N C46.1 U28.4)
Q4C+: 12vto15v mosfet control (U12.6), Power Supply (C36.P C38.2 U24.6)
Q4C-: 12vto15v mosfet control (U12.4), Power Supply (C36.N C38.1 U24.4)
VGND: DCtoAC Schematic (6 pins), Phase  A (7 pins), Phase B (7 pins), Phase C (7 pins)